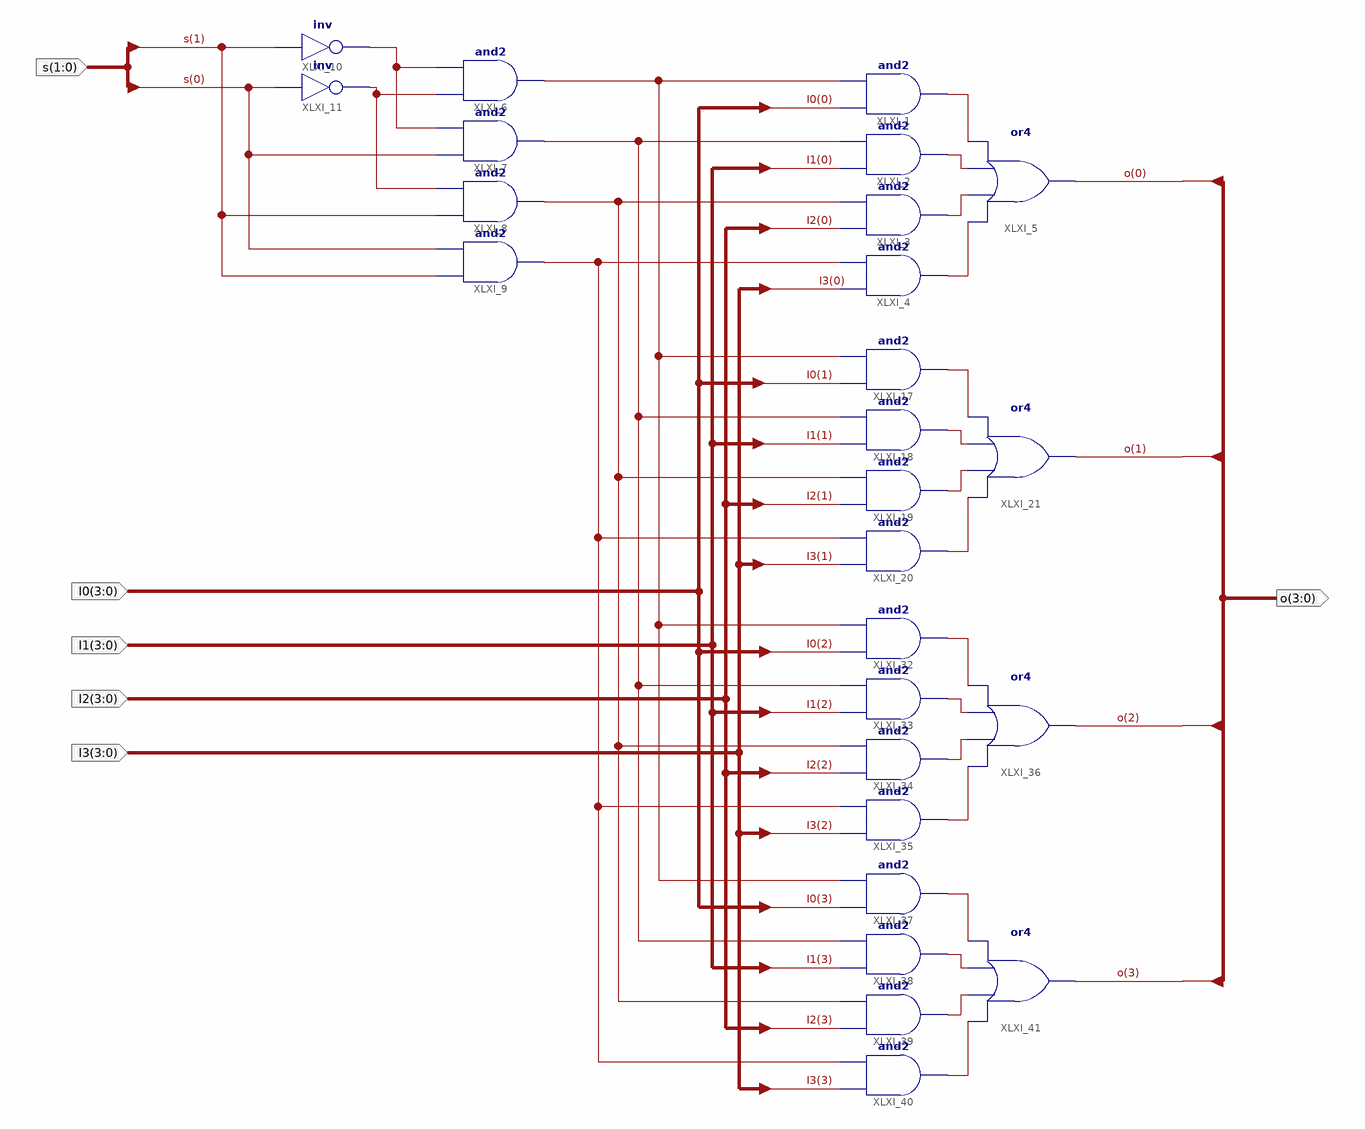
[diagram p0: schematic sheet 1]
// Xilinx ISE schematic MUX4T1_4.sch (kintex7) as structural Verilog: 26 symbols, 6 ports
module MUX4T1_4 (
  input  [1:0] s,
  input  [3:0] I0,
  input  [3:0] I1,
  input  [3:0] I2,
  input  [3:0] I3,
  output [3:0] o
);

  wire XLXN_1, XLXN_2, XLXN_3, XLXN_4, XLXN_5, XLXN_6, XLXN_9, XLXN_12, XLXN_51, XLXN_52, XLXN_58, XLXN_59,
       XLXN_61, XLXN_62, XLXN_73, XLXN_74, XLXN_76, XLXN_77, XLXN_78, XLXN_79, XLXN_81, XLXN_82;

  and XLXI_1 (XLXN_1, I0[0], XLXN_5);
  and XLXI_2 (XLXN_2, I1[0], XLXN_6);
  and XLXI_3 (XLXN_3, I2[0], XLXN_51);
  and XLXI_4 (XLXN_4, I3[0], XLXN_52);
  or XLXI_5 (o[0], XLXN_4, XLXN_3, XLXN_2, XLXN_1);
  and XLXI_6 (XLXN_5, XLXN_12, XLXN_9);
  and XLXI_7 (XLXN_6, s[0], XLXN_9);
  and XLXI_8 (XLXN_51, s[1], XLXN_12);
  and XLXI_9 (XLXN_52, s[1], s[0]);
  not XLXI_10 (XLXN_9, s[1]);
  not XLXI_11 (XLXN_12, s[0]);
  and XLXI_17 (XLXN_58, I0[1], XLXN_5);
  and XLXI_18 (XLXN_59, I1[1], XLXN_6);
  and XLXI_19 (XLXN_61, I2[1], XLXN_51);
  and XLXI_20 (XLXN_62, I3[1], XLXN_52);
  or XLXI_21 (o[1], XLXN_62, XLXN_61, XLXN_59, XLXN_58);
  and XLXI_32 (XLXN_73, I0[2], XLXN_5);
  and XLXI_33 (XLXN_74, I1[2], XLXN_6);
  and XLXI_34 (XLXN_76, I2[2], XLXN_51);
  and XLXI_35 (XLXN_77, I3[2], XLXN_52);
  or XLXI_36 (o[2], XLXN_77, XLXN_76, XLXN_74, XLXN_73);
  and XLXI_37 (XLXN_78, I0[3], XLXN_5);
  and XLXI_38 (XLXN_79, I1[3], XLXN_6);
  and XLXI_39 (XLXN_81, I2[3], XLXN_51);
  and XLXI_40 (XLXN_82, I3[3], XLXN_52);
  or XLXI_41 (o[3], XLXN_82, XLXN_81, XLXN_79, XLXN_78);
endmodule
